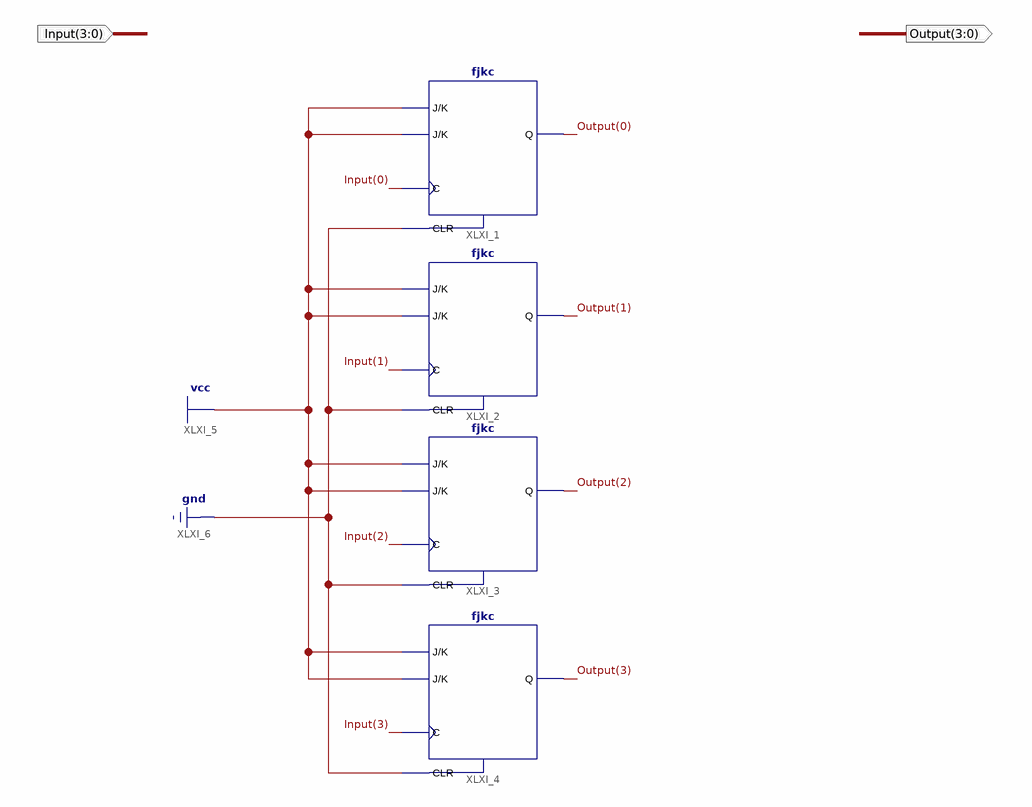
[diagram p0: schematic sheet 1]
// Xilinx ISE schematic ModeSelector.sch (spartan6) as structural Verilog: 4 symbols, 2 ports
module ModeSelector (
  input  [3:0] Input,
  output [3:0] Output
);

  fjkc XLXI_1 (.C(Input[0]), .CLR(1'b0), .J(1'b1), .K(1'b1), .Q(Output[0]));
  fjkc XLXI_2 (.C(Input[1]), .CLR(1'b0), .J(1'b1), .K(1'b1), .Q(Output[1]));
  fjkc XLXI_3 (.C(Input[2]), .CLR(1'b0), .J(1'b1), .K(1'b1), .Q(Output[2]));
  fjkc XLXI_4 (.C(Input[3]), .CLR(1'b0), .J(1'b1), .K(1'b1), .Q(Output[3]));
endmodule
